# EAGLE design riffle-beta-0.1.3 (EAGLE 7.3.0)
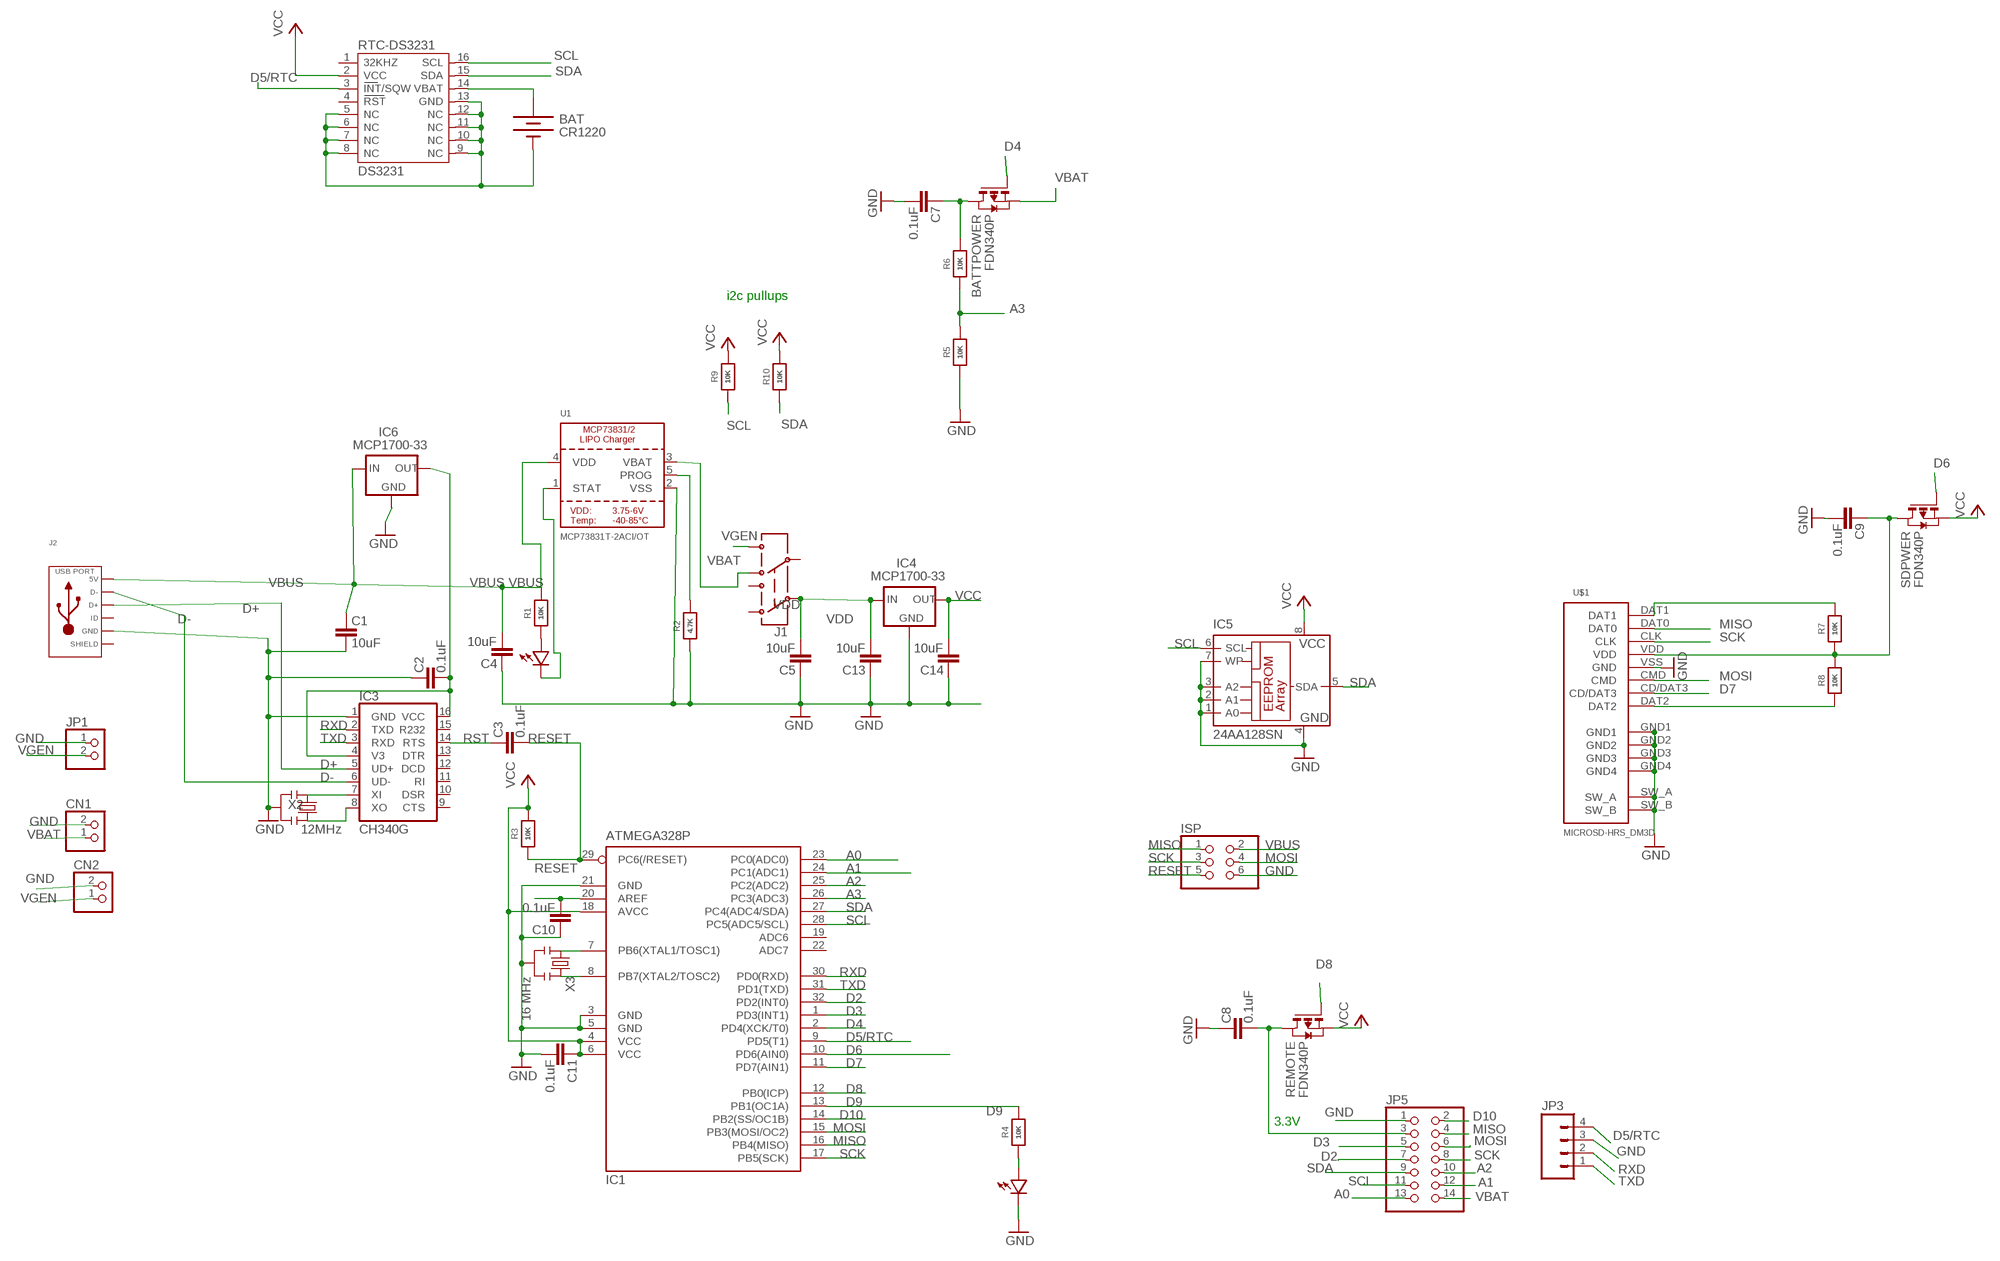
[diagram p0: schematic, sheet 1]

## Parts
BAT  CR1220  BATTERYBATTERY_12MM_SMT  [BATTCON_12MM_SMT]
BATTPOWER  FDN340P  PMOSSOT23  [SOT-23]
C1  10uF  CAP0603-CAP  [0603-CAP]
C2  0.1uF  CAP0603-CAP  [0603-CAP]
C3  0.1uF  CAP0603-CAP  [0603-CAP]
C4  10uF  CAP0603-CAP  [0603-CAP]
C5  10uF  CAP0603-CAP  [0603-CAP]
C7  0.1uF  CAP0603-CAP  [0603-CAP]
C8  0.1uF  CAP0603-CAP  [0603-CAP]
C9  0.1uF  CAP0603-CAP  [0603-CAP]
C10  0.1uF  CAP0603-CAP  [0603-CAP]
C11  0.1uF  CAP0603-CAP  [0603-CAP]
C13  10uF  CAP0603-CAP  [0603-CAP]
C14  10uF  CAP0603-CAP  [0603-CAP]
CN1  JST_2PIN-SMT-RA  [JST-PH-2-SMT-RA]
CN2  JST_2PIN-SMT-RA  [JST-PH-2-SMT-RA]
D1  LED0603  [0603-LED]
D2  LED0603  [0603-LED]
IC1  ATMEGA328P  MEGA8-AI  [TQFP32-08]
IC3  CH340G  [SO16]
IC4  MCP1700-33  MCP1700SOT89  [SOT89]
IC5  24AA128SN  [SO-08]
IC6  MCP1700-33  MCP1700SOT89  [SOT89]
ISP  PINHD-2X3  [2X03]
J1  AYZ0202  [AYZ0202]
J2  USB_MICRO_RIGHT  [MICROUSB-RIGHT]
JP1  PINHD-1X2  [1X02]
JP3  M04SMD  [1X04-SMD]
JP5  PINHD-2X7  [2X07]
R1  10K  RESISTOR_0603_NOOUT  [0603-NO]
R2  4.7K  RESISTOR_0603_NOOUT  [0603-NO]
R3  10K  RESISTOR_0603_NOOUT  [0603-NO]
R4  10K  RESISTOR_0603_NOOUT  [0603-NO]
R5  10K  RESISTOR_0603_NOOUT  [0603-NO]
R6  10K  RESISTOR_0603_NOOUT  [0603-NO]
R7  10K  RESISTOR_0603_NOOUT  [0603-NO]
R8  10K  RESISTOR_0603_NOOUT  [0603-NO]
R9  10K  RESISTOR_0603_NOOUT  [0603-NO]
R10  10K  RESISTOR_0603_NOOUT  [0603-NO]
REMOTE  FDN340P  PMOSSOT23  [SOT-23]
RTC-DS3231  DS3231  [DS3231]
SDPWER  FDN340P  PMOSSOT23  [SOT-23]
U1  MCP73831T-2ACI/OT  MCP73831/2  [SOT23-5]
U$1  MICROSD-HRS_DM3D  [DM3D]
X2  12MHz  RESONATORSMD  [RESONATOR-SMD]
X3  16 MHz  RESONATORSMD  [RESONATOR-SMD]

## Nets
A0: IC1.23(PC0(ADC0)) JP5.13
A1: IC1.24(PC1(ADC1)) JP5.12
A2: IC1.25(PC2(ADC2)) JP5.10
A3: IC1.26(PC3(ADC3)) R5.2 R6.1
AREF: C10.1 IC1.20(AREF)
D2: IC1.32(PD2(INT0)) JP5.7
D3: IC1.1(PD3(INT1)) JP5.5
D4: BATTPOWER.3(G) IC1.2(PD4(XCK/T0))
D5/RTC: IC1.9(PD5(T1)) JP3.4 RTC-DS3231.3(INT/SQW)
D6: IC1.10(PD6(AIN0)) SDPWER.3(G)
D7: IC1.11(PD7(AIN1)) U$1.CD/DAT3
D8: IC1.12(PB0(ICP)) REMOTE.3(G)
D9: IC1.13(PB1(OC1A)) R4.2
D10: IC1.14(PB2(SS/OC1B)) JP5.2
D+: IC3.5(UD+) J2.3(D+)
D-: IC3.6(UD-) J2.2(D-)
GND: BAT.P$1(-) C1.1 C2.2 C4.2 C5.2 C7.1 C8.2 C9.1 C10.2 C11.1 C13.2 C14.2 CN1.2 CN2.2 D2.MINUS IC1.3(GND) IC1.5(GND) IC1.21(GND) IC3.1(GND) IC4.1(GND) IC5.1(A0) IC5.2(A1) IC5.3(A2) IC5.4(GND) IC5.7(WP) IC6.1(GND) ISP.6 J2.5(GND) JP1.1 JP3.3 JP5.1 R2.1 R5.1 RTC-DS3231.5(NC) RTC-DS3231.6(NC) RTC-DS3231.7(NC) RTC-DS3231.8(NC) RTC-DS3231.9(NC) RTC-DS3231.10(NC) RTC-DS3231.11(NC) RTC-DS3231.12(NC) RTC-DS3231.13(GND) U1.2(VSS) U$1.GND1 U$1.GND2 U$1.GND3 U$1.GND4 U$1.SW_A U$1.SW_B U$1.VSS(GND) X2.2 X3.2
MISO: IC1.16(PB4(MISO)) ISP.1 JP5.4 U$1.DAT0
MOSI: IC1.15(PB3(MOSI/OC2)) ISP.4 JP5.6 U$1.CMD
N$1: D1.PLUS R1.1
N$2: IC1.7(PB6(XTAL1/TOSC1)) X3.1
N$3: IC1.8(PB7(XTAL2/TOSC2)) X3.3
N$4: C9.2 R7.1 R8.2 SDPWER.1(D) U$1.VDD
N$5: D1.MINUS U1.1(STAT)
N$6: R2.2 U1.5(PROG)
N$7: C8.1 JP5.3 REMOTE.1(D)
N$8: C2.1 IC3.4(V3) IC3.16(VCC) IC6.3(OUT)
N$11: IC3.7(XI) X2.1
N$13: IC3.8(XO) X2.3
N$15: BATTPOWER.1(D) C7.2 R6.2
N$16: R7.2 U$1.DAT1
N$17: D2.PLUS R4.1
N$18: R8.1 U$1.DAT2
RESET: C3.1 IC1.29(PC6(/RESET)) ISP.5 R3.1
RST: C3.2 IC3.14(RTS)
RTC_BATT: BAT.P$2(+) RTC-DS3231.14(VBAT)
RXD: IC1.30(PD0(RXD)) IC3.2(TXD) JP3.2
SCK: IC1.17(PB5(SCK)) ISP.3 JP5.8 U$1.CLK
SCL: IC1.28(PC5(ADC5/SCL)) IC5.6(SCL) JP5.11 R9.1 RTC-DS3231.16(SCL)
SDA: IC1.27(PC4(ADC4/SDA)) IC5.5(SDA) JP5.9 R10.1 RTC-DS3231.15(SDA)
TXD: IC1.31(PD1(TXD)) IC3.3(RXD) JP3.1
VBAT [vcc]: BATTPOWER.2(S) CN1.1 J1.6 JP5.14 U1.3(VBAT)
VBUS [vcc]: C1.2 C4.1 IC6.2(IN) ISP.2 J2.1(5V) R1.2 U1.4(VDD)
VCC: C11.2 C14.1 IC1.4(VCC) IC1.6(VCC) IC1.18(AVCC) IC4.3(OUT) IC5.8(VCC) R3.2 R9.2 R10.2 REMOTE.2(S) RTC-DS3231.2(VCC) SDPWER.2(S)
VDD: C5.1 C13.1 IC4.2(IN) J1.2
VGEN: CN2.1 J1.4 JP1.2
Unconnected: IC1.19(ADC6) IC1.22(ADC7) IC3.9(CTS) IC3.10(DSR) IC3.11(RI) IC3.12(DCD) IC3.13(DTR) IC3.15(R232) J1.1 J1.3 J1.5 J2.4(ID) RTC-DS3231.1(32KHZ) RTC-DS3231.4(RST)

## Notes on the sheet
- i2c pullups
- 3.3V

## Power pins joined to a net without a drawn wire
SLD: J2.S1(SLD) J2.S2(SLD) J2.S3(SLD) J2.S4(SLD) J2.S5(SLD) J2.S6(SLD) J2.S7(SLD) J2.S8(SLD)

## Library data of the parts
BAT = SparkFunNew:BATTERY: Battery Holders Various common sizes : AA, AAA, 20mm coin cell and 12mm coin cell.
BATTPOWER REMOTE SDPWER = zetex:PMOSSOT23: MOS FET; OC_FARNELL: unknown; OC_NEWARK: unknown
C1-C5 C7-C11 C13 C14 = SparkFun:CAP: Capacitor Standard 0603 ceramic capacitor, and 0.1" leaded capacitor.
CN1 CN2 = adafruit:JST_2PIN: JST 2-Pin Connectors of various flavors SMT-RA (S2B-PH-SM4) 4UConnector #17311 SMT (B2B-PH-SM4) THM-RA (S2B-PH) THM (B2B-PH)
D1 D2 = LowPowerLab:LED
IC1 = atmel:MEGA8: MICROCONTROLLER 8 Kbytes FLASH, 1 kbytes SRAM, 512 bytes EEPROM, USART, 6-channel 10 bit ADC, 2-channel 8 bit ADC Pin compatible with Atmega48, ATMega88, ATMega168 Source: avr.lbr; MPN: ATMEGA8-16AU; OC_FARNELL: 9171371; OC_NEWARK: 73M8863
IC3 = SparkFunNew:CH340
IC4 IC6 = adafruit:MCP1700: VOLTAGE REGULATOR
IC5 = microchip:24*: Serial EEPROM I2C; MF: MICROCHIP; MPN: 24AA128-I/SN; OC_FARNELL: unknown; OC_NEWARK: 92C6842
ISP = pinhead:PINHD-2X3: PIN HEADER
J1 = SparkFunNew:AYZ0202: SPDT Slide Switch Simple SMD single-pull double-throw slide switch. Good for less than 350mA power switch, switching UARTs between devices, etc. Spark Fun Electronics SKU : COM-00597
J2 = MF_Connectors:USB: Library: MF_Connectors Description: 5 Pin USB Connectors. SLD is the shield connection. Usually tied to ground through a small ferrite bead.
JP1 = pinhead:PINHD-1X2: PIN HEADER
JP3 = SparkFun:M04: Header 4 Standard 4-pin 0.1" header. Use with straight break away headers (SKU : PRT-00116), right angle break away headers (PRT-00553), swiss pins (PRT-00743), machine pins (PRT-00117), and female headers (PRT-00115). Molex polarized connector foot print use with SKU : PRT-08231 with associated crimp pins and housings.
JP5 = pinhead:PINHD-2X7: PIN HEADER
R1-R10 = microbuilder:RESISTOR: Resistors For new designs, use the packages preceded by an '_' character since they are more reliable: The following footprints should be used on most boards: _0402 - Standard footprint for regular board layouts _0603 - Standard footprint for regular board layouts _0805 - Standard footprint for regular board layouts _1206 - Standard footprint for regular board layouts For extremely tight-pitch boards where space is at a premium, the following 'micro-pitch' footprints can be used (smaller pads, no silkscreen outline, etc.): _0402MP - Micro-pitch footprint for very dense/compact boards _0603MP - Micro-pitch footprint for very dense/compact boards _0805MP - Micro-pitch footprint for very dense/compact boards _1206MP - Micro-pitch footprint for very dense/compact boards
RTC-DS3231 = _lh-library:DS3231
U1 = microbuilder:MCP73831/2: MCP73831/2 LIPO Charger VDD: 3.75 - 6V Temp -40 - 85°C Programmable Charge Rate: 15-500mA NOTE: STAT is a tri-state logic output on the MCP73831 and an open-drain output on the MCP73832. SOT23-5 with 4.2V output and tri-state logic on STAT = MCP73831T-2ACI/OT
U$1 = hrs_DM3D-SF:MICROSD-HRS_DM3D
X2 = SparkFunNew:RESONATOR: Resonator Small SMD resonator. This is the itty bitty 10/20MHz resonators with built in caps. CSTCE10M0G55 and CSTCE20M0V53. Footprint has been reviewed closely but hasn't been tested yet.
X3 = SparkFun:RESONATOR: Resonator Small SMD resonator. This is the itty bitty 10/20MHz resonators with built in caps. CSTCE10M0G55 and CSTCE20M0V53. Footprint has been reviewed closely but hasn't been tested yet.

## Board
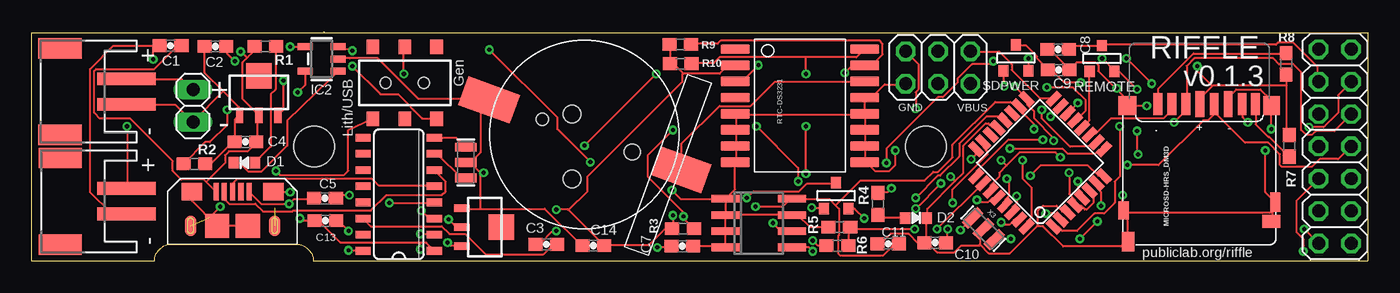
[diagram p1: board, top side]
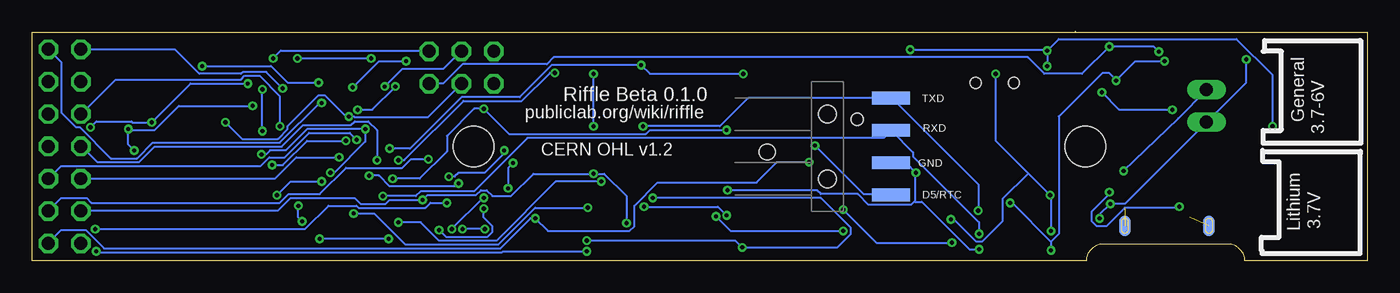
[diagram p2: board, bottom side, seen from below]

Size 104.8 x 18.01 mm. Coordinates in mm from the lower left corner, seen from the top.
Outline: 22.91,18.01 22.96,18.01
Outline: 0,0 0,17.96 104.8,17.96 104.8,0 22.07,0 arc90 20.75,1.32 10.95,1.32 arc90 9.63,0 0,0
Copper layers (1*16): Top 0.0356mm / dielectric 1.5011mm / Bottom 0.0356mm
Design rules "LaenPCBOrder": minimum track width 6mil, minimum drill 13mil, track to track 6mil, track to pad 6mil, pad to pad 6mil, via to via 6mil, smd to smd 6mil, copper to edge 15mil, drill to drill 6mil, minimum pad ring 7mil, minimum via ring 7mil, stop-mask expansion 3mil, vias tented up to drill 0mil, thermal gap 10mil
Holes 3.2 mm at 70.13,9 22.13,9

### Footprints (pad centres in the part's own frame; a part is rotated, then mirrored left to right if it is on the bottom)
BATTCON_12MM_SMT = smd 2.4 x 4.3: P$1 0,11.96 | smd 2.4 x 4.2: P$2 0,-4.1 | hole 0.95: 0,7.5 | hole 1.25: 0,0
SOT-23 = smd 0.787 x 0.889: 1 0.025,-1.016; 2 -0.94,1.016; 3 0.991,1.016
0603-CAP = smd 1.1 x 1: 1 -0.85,0; 2 0.85,0
JST-PH-2-SMT-RA = smd 1 x 4.6: 1 1,-3.7; 2 -1,-3.7 | smd 1.6 x 3.4: NC1 -3.4,1.5; NC2 3.4,1.5
0603-LED = smd 0.8 x 0.9: MINUS -0.85,0; PLUS 0.85,0
TQFP32-08 = smd 1.27 x 0.559: 1 -4.293,2.8; 2 -4.293,2; 3 -4.293,1.2; 4 -4.293,0.4; 5 -4.293,-0.4; 6 -4.293,-1.2; 7 -4.293,-2; 8 -4.293,-2.8; 17 4.293,-2.8; 18 4.293,-2; 19 4.293,-1.2; 20 4.293,-0.4; 21 4.293,0.4; 22 4.293,1.2; 23 4.293,2; 24 4.293,2.8 | smd 0.559 x 1.27: 9 -2.8,-4.293; 10 -2,-4.293; 11 -1.2,-4.293; 12 -0.4,-4.293; 13 0.4,-4.293; 14 1.2,-4.293; 15 2,-4.293; 16 2.8,-4.293; 25 2.8,4.293; 26 2,4.293; 27 1.2,4.293; 28 0.4,4.293; 29 -0.4,4.293; 30 -1.2,4.293; 31 -2,4.293; 32 -2.8,4.293
SO16 = smd 0.6 x 1.2: 1 -4.445,-2.8; 2 -3.175,-2.8; 3 -1.905,-2.8; 4 -0.635,-2.8; 5 0.635,-2.8; 6 1.905,-2.8; 7 3.175,-2.8; 8 4.445,-2.8; 9 4.445,2.8; 10 3.175,2.8; 11 1.905,2.8; 12 0.635,2.8; 13 -0.635,2.8; 14 -1.905,2.8; 15 -3.175,2.8; 16 -4.445,2.8
SOT89 = smd 0.58 x 1.2: 1 -1.5,-1.8; 2 0,-1.8; 3 1.5,-1.8 | smd 2 x 2: 4 0,1.3
SO-08 = smd 0.6 x 2.2: 1 -1.905,-2.6; 2 -0.635,-2.6; 3 0.635,-2.6; 4 1.905,-2.6; 5 1.905,2.6; 6 0.635,2.6; 7 -0.635,2.6; 8 -1.905,2.6
2X03 = drill 1.016 octagon: 1 -2.54,-1.27; 2 -2.54,1.27; 3 0,-1.27; 4 0,1.27; 5 2.54,-1.27; 6 2.54,1.27
AYZ0202 = smd 1 x 1.15: 1 -2.5,2.825; 2 0,2.825; 3 2.5,2.825; 4 -2.5,-2.825; 5 0,-2.825; 6 2.5,-2.825 | hole 0.85: 1.5,0; -1.5,0
MICROUSB-RIGHT = smd 0.4 x 1.35: 1 -1.3,1.27; 2 -0.65,1.27; 3 0,1.27; 4 0.65,1.27; 5 1.3,1.27 | smd 0.9 x 1.6: S1 -3.3,-1.4; S2 3.3,-1.4 | smd 1.6 x 1.4: S3 -3.2,1.27; S4 3.2,1.27 | smd 1.9 x 1.9: S5 -1.2,-1.405; S6 1.2,-1.405 | smd 0.9 x 1.6 bottom: S7 -3.3,-1.4; S8 3.3,-1.4
1X02 = drill 1.016 long: 1 -1.27,0; 2 1.27,0
1X04-SMD = smd 1 x 3: 1 -3.81,5; 2 -1.27,5; 3 1.27,5; 4 3.81,5 | hole 1.4: -2.54,0; 2.54,0
2X07 = drill 1.016 octagon: 1 -7.62,-1.27; 2 -7.62,1.27; 3 -5.08,-1.27; 4 -5.08,1.27; 5 -2.54,-1.27; 6 -2.54,1.27; 7 0,-1.27; 8 0,1.27; 9 2.54,-1.27; 10 2.54,1.27; 11 5.08,-1.27; 12 5.08,1.27; 13 7.62,-1.27; 14 7.62,1.27
0603-NO = smd 1.1 x 1: 1 -0.85,0; 2 0.85,0
DS3231 = smd 0.762 x 2.286: 1 -4.445,-5.08; 2 -3.175,-5.08; 3 -1.905,-5.08; 4 -0.635,-5.08; 5 0.635,-5.08; 6 1.905,-5.08; 7 3.175,-5.08; 8 4.445,-5.08; 9 4.445,5.08; 10 3.175,5.08; 11 1.905,5.08; 12 0.635,5.08; 13 -0.635,5.08; 14 -1.905,5.08; 15 -3.175,5.08; 16 -4.445,5.08
SOT23-5 = smd 0.55 x 1.2: 1 -0.95,-1.3; 2 0,-1.3; 3 0.95,-1.3; 4 0.95,1.3; 5 -0.95,1.3
DM3D = smd 0.7 x 1.75: CD/DAT3 8.15,0.45; CLK 4.85,0.45; CMD 7.05,0.45; DAT0 2.65,0.45; DAT1 1.6,0.45; DAT2 9.25,0.45 | smd 0.8 x 1.5: GND1 0.05,8.15 | smd 0.8 x 1.4: GND2 11.95,8.8 | smd 1.4 x 1.5: GND3 11.65,0.55 | smd 1.3 x 1.5: GND4 0.35,0.55 | smd 1 x 1.55: SW_A 11.6,11.25 | smd 1.4 x 1: SW_B 0.35,9.65 | smd 0.7 x 2.032: VDD 5.95,0.45; VSS 3.75,0.45
RESONATOR-SMD = smd 0.7 x 1.7: 1 -1.2,0; 2 0,0; 3 1.2,0

### Placement (x,y rotation side)
BAT  47.1,8.57 70 top
BATTPOWER  63.12,5.14 180 top
C1  10.88,16.92 0 top
C2  14.39,16.86 180 top
C3  40.37,1.31 0 top
C4  16.76,9.37 180 top
C5  23,4.94 180 top
C7  51.03,1.17 180 top
C8  80.53,16.62 180 top
C9  80.57,15.01 180 top
C10  70.86,1.44 180 top
C11  67.19,1.36 0 top
C13  23.04,3.17 180 top
C14  44.04,1.22 180 top
CN1  3.72,4.7 90 top
CN2  3.71,13.31 90 top
D1  16.67,7.72 0 top
D2  69.37,3.38 180 top
IC1  79.09,7.72 135 top
IC3  28.79,5.24 90 top
IC4  35.53,2.67 270 top
IC5  57.02,2.98 270 top
IC6  17.81,13.26 0 top
ISP  71.1,15.2 180 top
J1  29.26,14 0 top
J2  15.75,4.17 0 top
JP1  12.64,12.2 90 top
JP3  42.39,9 270 bottom
JP5  102.23,9.01 270 top
R1  18.32,16.87 180 top
R2  12.74,7.65 180 top
R3  51.09,2.55 180 top
R4  66.37,4.5 90 top
R5  63.35,2.66 0 top
R6  63.2,1.22 180 top
R7  98.65,9.05 270 top
R8  98.4,15.49 270 top
R9  50.91,15.5 180 top
R10  50.88,17.03 180 top
REMOTE  83.98,15.91 180 top
RTC-DS3231  60.27,12.21 270 top
SDPWER  77.23,15.95 180 top
U1  22.73,15.88 90 top
U$1  97.6,12.78 180 top
X2  34.06,7.74 90 top
X3  74.66,2.55 135 top

### Tracks (layer width: path | path; a pad name or v marks a point on that pad's centre or on a via)
A0  (via drill 0.33)
  Top 0.152: v72.24,4.57 72.24,5.64 74.98,8.38 74.98,8.61 74.68,8.91 74.68,9.3 IC1.23 | v99.82,2.52 100.89,1.45 JP5.13
  Bottom 0.152: v72.24,4.57 73.53,4.57 73.91,4.19 79.17,4.19 79.32,4.34 81.53,4.34 83.36,2.52 v99.82,2.52
A1  (via drill 0.33)
  Top 0.152: v73.69,8 74.07,8.38 74.07,8.76 IC1.24
  Bottom 0.152: v73.69,8 75.06,8 75.74,7.32 80.16,7.32 82.22,5.26 84.66,5.26 85.34,4.57 100.13,4.57 100.51,4.95 102.49,4.95 103.48,3.96 JP5.12
A2  (via drill 0.33)
  Top 0.152: v79.32,9.53 76.58,9.53 74.14,7.09 74.14,6.71 IC1.25
  Bottom 0.152: v79.32,9.53 79.86,10.06 83.06,10.06 84.96,8.15 86.18,8.15 86.87,7.47 102.49,7.47 103.48,6.48 JP5.10
A3  (via drill 0.33)
  Top 0.152: R6.1 64.08,1.22 64.08,2.52 64.16,2.59 R5.2 64.16,2.52 v69.27,2.52 | v71.02,2.52 74.6,6.1 IC1.26
  Bottom 0.152: v69.27,2.52 v71.02,2.52
AREF  (via drill 0.33)
  Top 0.152: v71.86,2.52 71.78,2.44 71.78,1.45 C10.1 | v69.34,4.95 71.09,6.71 71.25,6.71 72.77,8.23 72.77,9.22 74.9,11.35 75.97,11.35 76.28,11.05 IC1.20
  Bottom 0.152: v71.86,2.52 69.42,4.95 v69.34,4.95
D2  (via drill 0.33)
  Top 0.152: v77.72,7.92 77.72,6.48 78.41,5.79 78.41,3.43 78.1,3.12 78.1,2.74 IC1.32
  Bottom 0.152: v77.72,7.92 77.72,10.29 78.41,10.97 79.48,10.97 79.78,10.67 83.52,10.67 85.19,8.99 95.17,8.99 96.39,7.77 99.67,7.77 100.89,8.99 JP5.7
D3  (via drill 0.33)
  Top 0.152: v85.34,10.59 85.34,6.63 84.96,6.25 84.96,4.57 84.12,3.73 83.36,3.73 81.99,2.36 80.85,2.36 80.54,2.67 80.16,2.67 IC1.1
  Bottom 0.152: v85.34,10.59 85.34,12.95 86.94,14.55 88.09,14.55 88.39,14.25 98.22,14.25 100.89,11.58 JP5.5
D4  (via drill 0.33)
  Top 0.152: v61.19,4.19 62.1,4.19 BATTPOWER.3 | v79.55,3.73 80.24,3.73 80.7,3.28 IC1.2
  Bottom 0.152: v61.19,4.19 65.3,4.19 68.2,1.29 75.51,1.29 77.95,3.73 v79.55,3.73
D5/RTC  (via drill 0.33)
  Top 0.152: v76.73,8.84 80.85,8.84 81.23,8.46 83.44,8.46 83.74,8.76 84.05,8.76 IC1.9 | v57,15.39 55.78,14.17 55.24,14.17 RTC-DS3231.3 | v49,14.71 v43.36,9.07
  Bottom 0.152: v76.73,8.84 75.13,8.84 71.09,12.88 66.52,12.88 64.01,15.39 v57,15.39 56.31,14.71 v49,14.71 | v43.36,9.07 39.55,5.26 37.41,5.26 JP3.4
D6  (via drill 0.33)
  Top 0.152: v76.28,13.72 76.28,14.94 SDPWER.3 | v79.25,11.89 79.25,11.2 81.46,8.99 83.21,8.99 83.52,9.3 IC1.10
  Bottom 0.152: v76.28,13.72 78.1,11.89 v79.25,11.89
D7
  Top 0.152: IC1.11 82.98,9.98 83.44,9.98 84.66,11.2 88.77,11.2 89.38,11.81 89.38,12.27 U$1.CD/DAT3
D8
  Top 0.152: REMOTE.3 82.98,14.86 82.98,11.05 82.45,10.52 IC1.12
D9  (via drill 0.33)
  Top 0.152: v67.44,5.71 67.13,5.41 66.45,5.41 R4.2 | v67.06,7.7 67.06,8.84 71.09,12.88 71.48,12.88 72.62,14.02 72.62,14.33 73.76,15.47 75.21,15.47 v75.44,15.7 | v79.63,13.64 81.69,13.64 82.68,12.65 82.68,11.81 81.91,11.05 IC1.13
  Bottom 0.152: v67.44,5.71 67.44,7.32 v67.06,7.7 | v75.44,15.7 77.57,15.7 v79.63,13.64
D10  (via drill 0.33)
  Top 0.152: v82.07,12.42 81.31,11.66 IC1.14
  Bottom 0.152: v82.07,12.42 82.22,12.42 85.34,9.3 95.33,9.3 96.55,8.08 98.6,8.08 101.04,10.52 101.35,10.52 102.49,11.66 102.49,15.62 103.48,16.61 JP5.2
D+
  Top 0.152: IC3.5 31.55,5.94 27.2,5.94 26.67,6.48 16.15,6.48 15.77,6.1 15.77,5.49 J2.3
D-
  Top 0.152: IC3.6 31.62,7.09 32.46,6.25 32.46,5.49 32.16,5.18 27.81,5.18 26.59,3.96 20.5,3.96 20.42,3.89 18.14,3.89 17.53,4.5 15.47,4.5 15.16,4.8 15.16,5.41 J2.2
GND  (via drill 0.33)
  Top 0.152: C8.2 79.71,16.61 79.86,16.61 81.38,15.09 C9.1 81.46,15.09 81.99,15.62 83.44,15.62 83.67,15.39 83.67,14.94 85.08,13.53 | 85.08,13.53 85.88,12.72 85.88,12.27 U$1.GND3 85.95,12.19 v87.48,12.19 | v85.12,13.56 85.08,13.53 | 78.91,2.78 76.73,0.61 75.06,0.61 74.41,1.26 | 78.91,2.78 78.94,2.82 78.94,3.96 79.32,4.34 80.39,4.34 80.85,3.89 81.23,3.89 IC1.3 | 74.41,1.26 74.37,1.29 74.37,2.29 74.6,2.52 X3.2 | 75.74,10.52 IC1.21 75.67,10.52 75.36,10.52 75.06,10.82 74.83,10.82 73.08,9.07 73.08,6.93 72.43,6.29 | C10.2 70.03,1.45 70.18,1.6 70.18,3.35 D2.MINUS 70.26,3.43 70.26,4.12 72.43,6.29 | C11.1 66.37,1.37 66.6,1.37 67.36,2.13 68.81,2.13 69.49,1.45 69.95,1.45 C10.2 | 74.41,1.26 74.37,1.22 72.92,1.22 72.39,0.69 71.02,0.69 70.18,1.52 C10.2 | U$1.VSS 93.88,12.34 93.88,12.88 94.49,13.49 96.39,13.49 97.23,12.65 97.23,12.27 U$1.GND4 97.23,12.19 v97.23,10.36 | 97.31,3.81 97.31,4.34 97.54,4.57 U$1.GND1 97.54,4.65 96.77,5.41 v96.77,8.69 | 97.31,3.81 97.31,3.2 U$1.SW_B | v82.07,6.25 82.07,5.71 82.37,5.41 82.37,5.03 IC1.5 | v85.57,5.18 85.57,4.12 85.65,4.04 U$1.GND2 | U$1.GND2 85.72,3.96 85.95,3.73 85.95,1.6 U$1.SW_A 85.88,1.6 85.42,1.14 80.92,1.14 79.32,2.74 78.94,2.74 78.91,2.78 | 97.31,3.81 85.95,3.81 U$1.GND2 | 9.52,16.92 6.4,16.92 4.57,15.09 4.57,5.41 6.25,3.73 7.39,3.73 CN1.2 | 9.52,16.92 9.98,16.92 C1.1 9.52,16.92 | 30.48,1.45 30.94,1.45 31.55,0.84 IC3.1 31.62,0.84 | 30.48,1.45 24.23,1.45 22.56,3.12 22.25,3.12 C13.2 22.17,3.2 21.18,3.2 v21.03,3.35 | C5.2 22.1,4.88 20.57,4.88 v20.19,4.5 17.98,4.5 17.07,5.41 J2.5 | R2.1 13.64,7.7 14.1,7.7 15.7,9.3 15.85,9.3 C4.2 15.93,9.37 15.93,11.12 16.23,11.43 IC6.1 16.23,11.51 16.23,12.12 15.01,13.34
  Top 0.152: 15.01,13.34 13.56,14.78 13.56,16.84 C2.2 | 15.01,13.34 12.65,10.97 JP1.1 12.57,10.97 11.28,12.27 7.47,12.27 CN2.2 | v9.52,15.85 9.52,16.92 | RTC-DS3231.12 65.38,11.51 65.38,10.36 RTC-DS3231.11 65.38,10.29 65.38,9.07 RTC-DS3231.10 65.38,8.99 65.38,7.77 RTC-DS3231.9 65.46,7.77 66.14,7.09 67.28,7.09 67.74,7.54 v67.74,8.69 | RTC-DS3231.12 65.38,11.58 65.38,12.8 RTC-DS3231.13 65.46,12.8 65.84,12.8 66.9,13.87 68.5,13.87 ISP.6 | R5.1 62.48,2.67 61.04,2.67 60.12,3.58 59.66,3.58 IC5.7 59.59,3.66 54.48,3.66 IC5.2 | IC5.2 54.41,3.66 54.41,4.88 IC5.1 | C7.1 51.89,1.14 54.41,1.14 IC5.4 | 54.41,1.07 IC5.4 | IC5.4 54.41,1.22 54.41,2.29 IC5.3 54.41,2.36 54.41,3.58 IC5.2 | IC5.1 54.48,4.95 55.17,5.64 55.17,7.7 RTC-DS3231.8 55.24,7.77 55.24,8.99 RTC-DS3231.7 55.24,9.07 55.24,10.29 RTC-DS3231.6 55.24,10.36 55.24,11.51 RTC-DS3231.5 55.32,11.51 65.3,11.51 RTC-DS3231.12 | 35.2,4.12 33.76,4.12 IC4.1 | 35.2,4.12 40.23,4.12 43.13,1.22 C14.2 | 35.2,6.93 34.44,7.7 34.06,7.7 X2.2 34.52,7.7 34.52,7.85 35.2,8.53 35.2,12.72 | 35.2,4.12 35.2,6.93 | 35.2,6.93 v35.43,6.93 | 24.94,15.93 27.13,15.93 30.33,12.72 35.2,12.72 | 35.2,12.72 35.81,12.72 BAT.P$1 35.2,12.72 | v50.22,5.56 50.9,4.88 54.33,4.88 IC5.1 | v30.48,0.91 30.48,1.45 | v72.09,6.63 72.43,6.29
  Top 0.154: 24.94,15.93 24.08,15.93 U1.2
  Bottom 0.152: v85.12,13.56 86.41,14.86 88.24,14.86 88.39,14.71 91.67,14.71 93.57,16.61 100.89,16.61 JP5.1 | v82.07,6.25 84.51,6.25 v85.57,5.18 | 97.23,10.29 97.23,9.14 v96.77,8.69 | v87.48,12.19 93.27,12.19 95.17,10.29 97.23,10.29 | 97.23,10.29 v97.23,10.36 | v21.03,3.35 21.03,3.66 v20.19,4.5 19.05,4.5 12.65,10.9 JP1.1 12.57,10.97 9.52,14.02 v9.52,15.85 | JP3.3 37.34,7.7 36.19,7.7 v35.43,6.93 35.51,6.93 35.51,4.72 35.55,4.69 | v50.22,5.56 43.21,5.56 42.9,5.26 40,5.26 39.17,4.42 35.81,4.42 35.55,4.69 | v30.48,0.91 31.24,0.91 34.98,4.65 35.51,4.65 35.55,4.69 | v72.09,6.63 71.63,6.63 71.32,6.93 69.27,6.93 67.74,8.46 v67.74,8.69
MISO  (via drill 0.33)
  Top 0.152: IC1.16 80.09,12.8 79.1,12.8 76.89,15.01 76.89,15.47 75.9,16.46 73.69,16.46 ISP.1 | v95.4,10.9 95.02,11.28 95.02,12.27 U$1.DAT0 | v100.2,10.52 101.35,10.52 102.49,11.66 102.49,13.03 103.48,14.02 JP5.4 | v87.86,13.95 v85.88,15.93
  Bottom 0.152: v100.2,10.52 99.75,10.97 97,10.97 96.93,10.9 v95.4,10.9 92.35,13.95 v87.86,13.95 | v85.88,15.93 85.27,16.54 73.69,16.54 ISP.1
MOSI  (via drill 0.33)
  Top 0.152: v79.93,11.35 80.7,12.12 IC1.15 | JP5.6 103.48,11.51 102.18,10.21 100.74,10.21 100.43,9.91 99.97,9.91 99.59,10.29 99.59,14.86 98.98,15.47 97.84,15.47 97.38,15.93 91.21,15.93 90.6,15.32 90.6,12.34 U$1.CMD 90.53,12.27 90.53,11.81 v89.61,10.9
  Bottom 0.152: ISP.4 71.17,13.87 73.76,11.28 79.48,11.28 79.55,11.35 v79.93,11.35 80.16,11.35 81.84,13.03 82.3,13.03 84.73,10.59 84.73,10.36 85.5,9.6 88.32,9.6 v89.61,10.9
N$1
  Top 0.152: D1.PLUS 17.53,7.77 18.75,8.99 18.75,13.11 19.13,13.49 19.13,16.84 R1.1
N$2  (via drill 0.33)
  Top 0.152: v83.9,4.34 83.9,5.41 83.59,5.71 83.59,6.1 IC1.7 | v82.22,1.75 v83.59,3.12 | v76.81,1.75 75.51,1.75 X3.1
  Bottom 0.152: v83.9,4.34 83.9,3.43 v83.59,3.12 | v76.81,1.75 v82.22,1.75
N$3  (via drill 0.33)
  Top 0.152: v78.33,6.71 79.17,7.54 82.83,7.54 83.67,6.71 84.05,6.71 IC1.8 | v69.34,4.12 v71.32,6.1 | v72.85,2.44 73.76,3.35 X3.3
  Bottom 0.152: v78.33,6.71 77.57,6.71 76.73,5.87 71.55,5.87 v71.32,6.1 | v69.34,4.12 69.34,3.43 68.66,2.74 68.66,2.29 69.04,1.91 72.31,1.91 v72.85,2.44
N$4  (via drill 0.33)
  Top 0.152: SDPWER.1 77.27,16.92 78.03,16.92 78.87,16.08 78.87,15.93 79.71,15.09 C9.2 79.78,15.01 80.01,15.01 81,14.02 v82.3,14.02 | 98.45,13.79 98.45,10.06 98.6,9.91 R7.1 | 98.45,13.79 98.45,14.63 R8.2 | 92.62,13.75 92.66,13.79 98.45,13.79 | 92.62,13.75 91.67,12.8 91.67,12.34 U$1.VDD | v91.44,15.32 91.44,14.94 92.62,13.75
  Bottom 0.152: v82.3,14.02 84.73,14.02 86.03,15.32 v91.44,15.32
N$5
  Top 0.152: 23.37,14.25 20.04,11.05 20.04,9.07 17.98,7.01 16.99,7.01 16.31,7.7 15.85,7.7 D1.MINUS
  Top 0.154: 23.37,14.25 23.37,14.26 U1.1
N$6  (via drill 0.33)
  Top 0.154: U1.5 21.43,13.84 v20.85,13.26 | v15.32,11.89 15.32,10.69 13.97,9.35 13.6,9.35 R2.2
  Bottom 0.154: v20.85,13.26 19.51,11.91 15.34,11.91 v15.32,11.89
N$7
  Top 0.152: C8.1 81.38,16.69 81.61,16.92 83.9,16.92 REMOTE.1 83.97,16.99 97.61,16.99 97.76,17.14 98.98,17.14 100.89,15.24 100.89,14.1 JP5.3
N$8  (via drill 0.33)
  Top 0.152: v15.93,15.7 15.32,16.31 15.32,16.84 C2.1 | v19.74,14.17 19.74,11.89 19.35,11.51 IC6.3 | v24.84,0.84 25.98,0.84 IC3.16 | v28.04,4.57 31.55,4.57 IC3.4
  Bottom 0.152: v15.93,15.7 18.21,15.7 v19.74,14.17 19.74,14.25 20.27,14.78 20.8,14.78 24.23,11.35 24.23,2.13 24.84,1.52 | 24.84,1.52 v24.84,0.84 | v28.04,4.57 27.89,4.57 24.84,1.52
N$11
  Top 0.152: IC3.7 31.62,8.38 31.85,8.38 33.68,6.55 33.99,6.55 X2.1
N$13
  Top 0.152: IC3.8 31.62,9.68 33.3,9.68 33.99,8.99 X2.3
N$15  (via drill 0.33)
  Top 0.152: v56.08,4.95 56.62,5.49 60.2,5.49 60.81,6.1 63.09,6.1 BATTPOWER.1 | v49.07,1.07 50.06,1.07 50.14,1.14 C7.2 | v61.26,1.6 61.65,1.22 62.33,1.22 R6.2
  Bottom 0.152: v56.08,4.95 42.9,4.95 40.54,2.59 40.54,2.13 41.61,1.07 v49.07,1.07 49.61,1.6 v61.26,1.6
N$16
  Top 0.152: R7.2 98.6,8.23 97.08,9.75 97,9.75 96.01,10.74 96.01,12.27 U$1.DAT1
N$17
  Top 0.152: D2.PLUS 68.5,3.43 66.6,3.43 66.45,3.58 R4.1
N$18
  Top 0.152: R8.1 98.37,16.31 91.14,16.31 88.39,13.56 88.39,12.34 U$1.DAT2
RESET  (via drill 0.33)
  Top 0.152: v41.15,2.36 40.84,2.36 39.85,1.37 39.55,1.37 C3.1 | R3.1 51.89,2.59 51.13,3.35 v51.13,3.5 51.13,3.81 48.31,6.63 48.31,8.31 v50.29,10.29 | v76.5,6.48 76.66,6.33 76.66,5.11 76.35,4.8 76.35,4.42 IC1.29 | v69.34,11.96 69.34,13.26 69.57,13.49 69.57,15.47 68.58,16.46 ISP.5
  Bottom 0.152: v41.15,2.36 49.99,2.36 v51.13,3.5 | v76.5,6.48 74.37,6.48 72.24,8.61 72.24,9.83 70.1,11.96 v69.34,11.96 67.36,9.98 56.62,9.98 56.31,10.29 v50.29,10.29
RST
  Top 0.152: C3.2 41.15,1.29 40.92,1.29 40.16,0.53 35.59,0.53 33.99,2.13 32.77,2.13 32.16,2.74 26.59,2.74 26.06,3.28 IC3.14
RTC_BATT
  Top 0.152: RTC-DS3231.14 65.3,14.1 58.29,14.1 56.39,12.19 53.95,12.19 50.98,9.22 50.98,7.24 BAT.P$2
RXD  (via drill 0.33)
  Top 0.152: v30.48,2.13 31.55,2.13 IC3.2 | v77.27,5.11 77.27,4.57 76.96,4.27 76.96,3.89 IC1.30
  Bottom 0.152: v30.48,2.13 30.48,3.05 35.66,8.23 35.66,8.53 37.34,10.21 JP3.2 37.41,10.21 37.95,9.68 65.91,9.68 70.1,5.49 74.29,5.49 74.68,5.11 v77.27,5.11
SCK  (via drill 0.33)
  Top 0.152: v77.11,13.72 78.03,12.8 IC1.17 78.1,12.72 78.1,12.27 78.64,11.73 78.64,11.2 80.16,9.68 v80.16,9.45 | JP5.8 103.48,8.99 102.49,8 101.04,8 100.43,7.39 98.07,7.39 97.92,7.54 97.92,8.38 97,9.3 95.17,9.3 92.81,11.66 92.81,12.27 U$1.CLK 92.81,11.58 92.28,11.05 91.9,11.05 88.39,7.54 v85.95,7.54
  Bottom 0.152: v77.11,13.72 75.74,15.09 72.54,15.09 71.17,16.46 ISP.3 | v80.16,9.45 83.21,9.45 85.12,7.54 v85.95,7.54
SCL  (via drill 0.33)
  Top 0.152: 60.73,16 64.69,16 65.3,16.61 RTC-DS3231.16 | 60.73,16 53.95,16 53.49,15.54 51.82,15.54 R9.1 | v74.14,4.8 74.29,4.65 75.06,4.65 75.36,4.95 75.74,4.95 IC1.28 | v58.14,2.97 58.75,2.36 59.59,2.36 IC5.6 | v60.73,14.71 60.73,16 | v60.73,6.86 v60.73,10.59
  Bottom 0.152: JP5.11 100.89,3.96 85.5,3.96 84.51,4.95 79.48,4.95 79.02,4.5 77.04,4.5 76.73,4.8 v74.14,4.8 73.76,5.18 69.95,5.18 69.57,5.56 69.11,5.56 68.66,5.11 67.21,5.11 65.46,6.86 v60.73,6.86 59.89,6.86 58.14,5.11 v58.14,2.97 | v60.73,10.59 v60.73,14.71
SDA  (via drill 0.33)
  Top 0.152: R10.1 51.74,17.07 53.8,17.07 54.03,17.3 66.52,17.3 66.75,17.07 66.75,16.23 65.91,15.39 65.38,15.39 RTC-DS3231.15 65.3,15.32 64.31,15.32 v63.78,14.78 | 76.47,7.51 77.5,8.53 80.31,8.53 v80.7,8.15 | 76.47,7.51 75.9,6.93 75.9,6.63 75.21,5.94 75.21,5.56 IC1.27 | v61.26,0.76 60.96,1.07 59.66,1.07 IC5.5 | v99.75,0.76 99.75,1.75 99.21,2.29 99.21,4.72 100.89,6.4 JP5.9 | 76.47,7.51 v76.05,7.92
  Bottom 0.152: v80.7,8.15 84.05,8.15 85.72,6.48 100.89,6.48 JP5.9 | v61.26,0.76 67.82,0.76 67.89,0.69 99.67,0.69 v99.75,0.76 | v63.78,14.78 64.16,14.78 66.37,12.57 70.94,12.57 75.59,7.92 v76.05,7.92
SLD  (via drill 0.33)  (4 unrouted)
  Top 0.152: J2.S3 12.57,5.41 12.57,4.72 14.48,2.82 J2.S5 | v20.27,5.41 18.97,5.41 J2.S4 | v14.78,4.27 13.94,3.43 J2.S5 | J2.S6 16.92,2.82 14.55,2.82 J2.S5
  Bottom 0.152: v20.27,5.41 20.27,5.26 21.64,3.89 21.64,3.12 21.26,2.74 20.5,2.74 19.05,4.19 14.86,4.19 v14.78,4.27
TXD  (via drill 0.33)
  Top 0.152: v30.56,3.96 31.17,3.35 31.55,3.35 IC3.3 | v76.05,3.05 76.2,2.9 76.73,2.9 77.04,3.2 77.42,3.2 IC1.31 | v60.12,6.25 60.12,7.32 v56.85,10.59
  Bottom 0.152: v30.56,3.96 30.56,6.02 37.34,12.8 JP3.1 37.41,12.8 48.62,12.8 50.83,10.59 v56.85,10.59 | v76.05,3.05 74.29,3.05 72.85,1.6 68.35,1.6 63.7,6.25 v60.12,6.25
VBAT  (via drill 0.33)
  Top 0.152: v25.15,15.32 27.36,13.11 28.73,13.11 30.63,11.2 31.7,11.2 J1.6 | v25.15,16.54 24.82,16.64 24.41,16.74 | v7.47,10.59 7.47,5.71 CN1.1 | v65.3,3.35 64.54,4.12 64.08,4.12 BATTPOWER.2 | v35.89,16.61 41.22,11.28 41.22,10.36 v43.81,7.77
  Top 0.154: 24.41,16.74 24.12,16.74 U1.3
  Bottom 0.152: v25.15,16.54 v25.15,15.32 | v7.47,10.59 7.47,14.63 10.29,17.45 24.23,17.45 v25.15,16.54 | JP5.14 103.48,1.45 102.49,2.44 100.58,2.44 99.14,0.99 68.05,0.99 65.68,3.35 v65.3,3.35 64.31,2.36 57.91,2.36 57.53,2.74 57.53,4.34 55.7,6.17 47.93,6.17 46.33,7.77 v43.81,7.77 | v35.89,16.61 25.15,16.61 v25.15,16.54
VBUS  (via drill 0.33)
  Top 0.152: 13.68,6.21 14.4,5.49 J2.1 | 13.68,6.21 13.49,6.4 11.73,6.4 11.05,7.09 11.05,7.85 7.7,11.2 5.33,11.2 4.88,11.66 4.88,14.94 5.03,15.09 9.6,15.09 11.43,16.92 11.66,16.92 C1.2 | 16.88,15.96 16.54,15.62 16.54,12.72 17.75,11.51 IC6.2 17.75,11.43 17.68,11.35 17.68,9.37 C4.1 17.6,9.3 16.92,8.61 15.47,8.61 15.16,8.31 15.16,7.7 13.68,6.21 | 16.88,15.96 17.45,16.54 17.45,16.84 R1.2 | v20.27,16.84 21.06,16.84 | 16.88,15.96 v16.38,16.46
  Top 0.154: 21.06,16.84 21.42,16.84 U1.4
  Bottom 0.152: v16.38,16.46 16.76,16.84 v20.27,16.84 22.4,14.71 25.37,14.71 26.67,16 63.86,16 64.39,15.47 71.02,15.47 72.54,13.95 73.61,13.95 ISP.2
VCC  (via drill 0.33)
  Top 0.152: R10.2 50.06,16.99 50.06,15.54 R9.2 50.14,15.54 50.29,15.54 51.09,14.74 | 51.09,14.74 51.13,14.71 53.95,14.71 54.56,15.32 55.17,15.32 RTC-DS3231.2 | v32.61,1.45 32.84,1.22 33.68,1.22 IC4.3 | v41.15,4.04 42.06,4.04 42.1,4 | 42.1,4 44.88,1.22 C14.1 48.39,1.22 49.68,2.52 50.22,2.52 R3.2 50.29,2.59 v50.29,3.58 | 42.1,4 43.59,5.49 43.59,6.63 51.05,14.1 51.05,14.71 51.09,14.74 | v78.18,15.93 78.18,15.01 SDPWER.2 | v83.97,15.93 84.96,14.94 REMOTE.2 85.04,14.94 85.27,14.94 v86.72,13.49 | IC1.6 82.98,5.49 83.29,5.18 83.29,4.57 82.75,4.04 82.6,4.04 82.3,4.34 81.91,4.34 IC1.4 81.84,4.42 81.84,4.8 81.38,5.26 v81.38,6.93 | 63.06,4.38 62.56,4.88 59.66,4.88 IC5.8 | 63.06,4.38 63.32,4.12 63.32,2.06 63.25,1.98 63.25,0.61 63.4,0.46 66.83,0.46 67.67,1.29 67.97,1.29 C11.2 | 63.06,4.38 65,6.33 70.03,6.33 70.71,7.01 71.09,7.01 72.24,8.15 72.24,9.14 75.59,12.5 76.81,12.5 77.11,12.19 77.42,12.19 IC1.18 77.5,12.12 77.5,11.89 78.64,10.74 v78.64,10.36 | 59.59,4.88 IC5.8 | v86.72,10.21 86.72,8.46 v86.79,8.38 | v56.77,4.27 58.9,4.27 59.51,4.88 IC5.8
  Bottom 0.152: v32.61,1.45 38.56,1.45 v41.15,4.04 | v83.97,15.93 v78.18,15.93 | v81.38,6.93 81.08,6.93 78.64,9.37 v78.64,10.36 83.21,10.36 84.89,8.69 86.11,8.69 86.41,8.38 v86.79,8.38 | v86.72,10.21 v86.72,13.49 | v50.29,3.58 50.98,4.27 v56.77,4.27
VDD  (via drill 0.33)
  Top 0.152: v24.84,2.36 24.08,3.12 23.93,3.12 C13.1 | v24.92,5.18 24.16,5.18 23.93,4.95 C5.1 | v29.18,14.71 29.18,16.76 J1.2 | IC4.2 33.3,2.67 v32.69,3.28
  Bottom 0.152: v24.84,2.36 24.84,5.11 v24.92,5.18 26.63,6.9 | v29.18,14.71 29.18,9.45 26.63,6.9 | v32.69,3.28 32.46,3.28 30.71,1.52 30.25,1.52 28.65,3.12 28.65,4.88 26.63,6.9
VGEN  (via drill 0.33)
  Top 0.152: v19.15,7.09 19.46,6.78 24.51,6.78 24.82,7.09 24.82,10.29 26.75,11.2 J1.4 | CN2.1 7.47,14.25 11.81,14.25 12.57,13.49 JP1.2
  Bottom 0.152: v19.15,7.09 14.86,11.2 12.65,13.41 JP1.2

### Text on the board
tPlace: Gen | RIFFLE | Lith/USB | v0.1.3 | + | IC2 | GND | VBUS | - | publiclab.org/riffle
bPlace: General | Riffle Beta 0.1.0 | TXD | RXD | publiclab.org/wiki/riffle | 3.7-6V | GND | CERN OHL v1.2 | Lithium | D5/RTC | 3.7V